# Altium schematic sheet [04] - PWR 2V5, 1V8, 1V35.SchDoc
size A4; DocumentNumber: 4; SheetNumber: 4; SheetTotal: 15
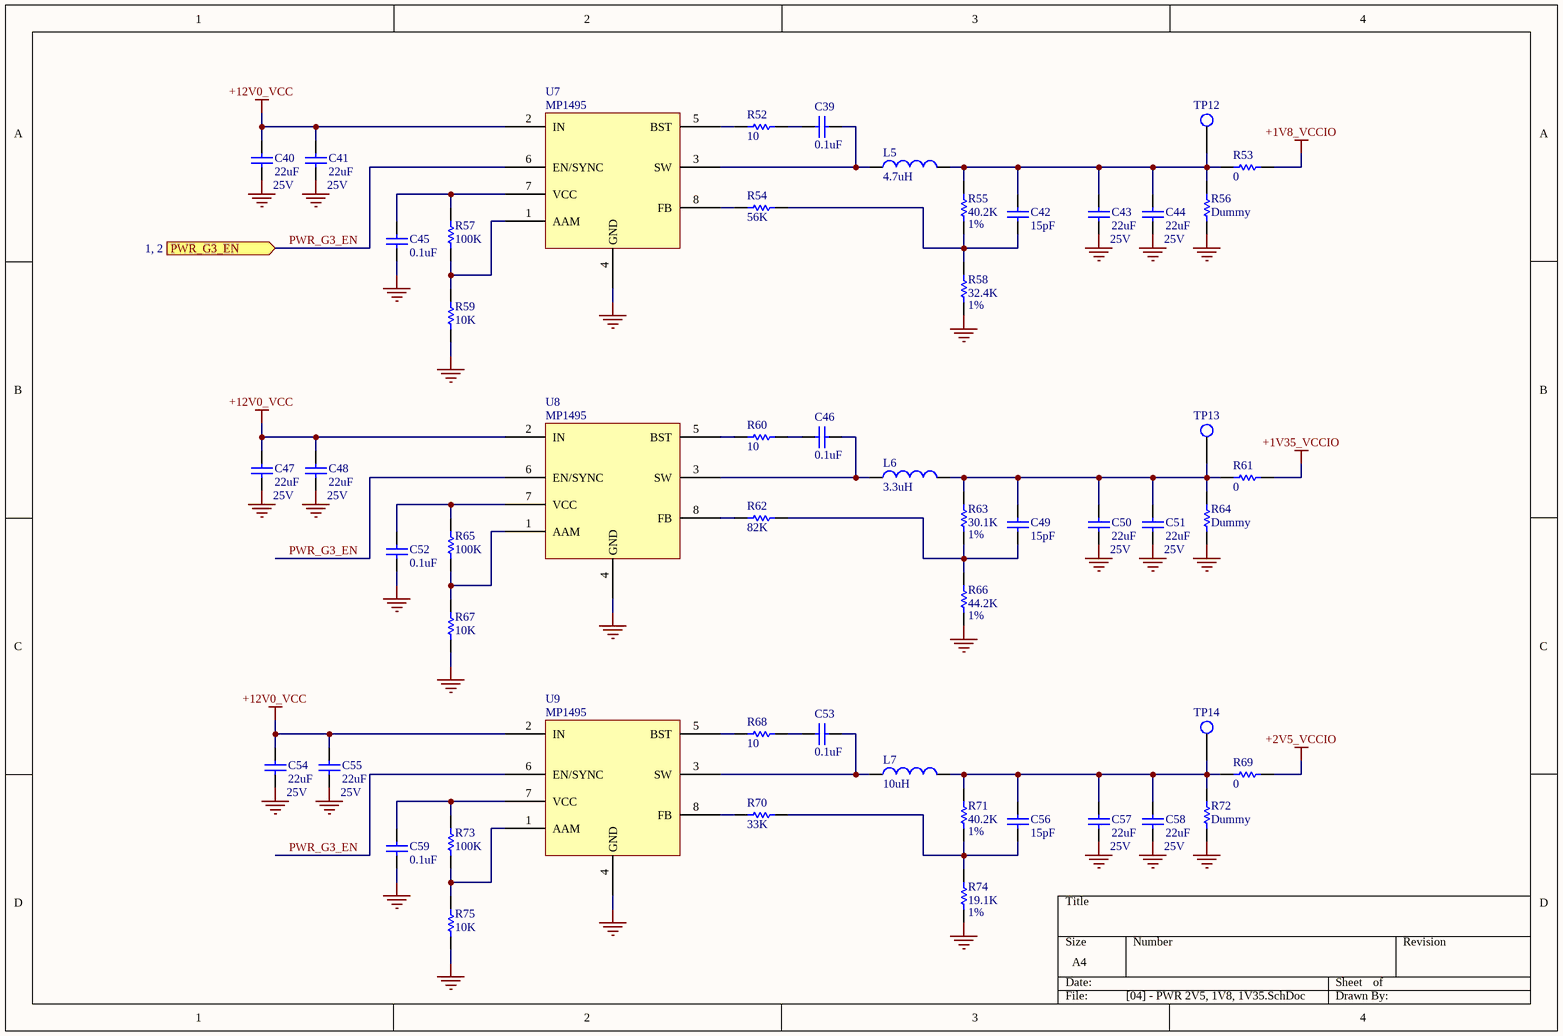
[diagram p0: [04] - PWR 2V5, 1V8, 1V35.SchDoc]

## Parts
C39  0.1uF  [0402_C]
C40  22uF  RATED_VOLTAGE: 25V  [1210_C]
C41  22uF  RATED_VOLTAGE: 25V  [1210_C]
C42  15pF  [0402_C]
C43  22uF  RATED_VOLTAGE: 25V  [1210_C]
C44  22uF  RATED_VOLTAGE: 25V  [1210_C]
C45  0.1uF  [0402_C]
C46  0.1uF  [0402_C]
C47  22uF  RATED_VOLTAGE: 25V  [1210_C]
C48  22uF  RATED_VOLTAGE: 25V  [1210_C]
C49  15pF  [0402_C]
C50  22uF  RATED_VOLTAGE: 25V  [1210_C]
C51  22uF  RATED_VOLTAGE: 25V  [1210_C]
C52  0.1uF  [0402_C]
C53  0.1uF  [0402_C]
C54  22uF  RATED_VOLTAGE: 25V  [1210_C]
C55  22uF  RATED_VOLTAGE: 25V  [1210_C]
C56  15pF  [0402_C]
C57  22uF  RATED_VOLTAGE: 25V  [1210_C]
C58  22uF  RATED_VOLTAGE: 25V  [1210_C]
C59  0.1uF  [0402_C]
L5  4.7uH  [IHLP-2525]
L6  3.3uH  [IHLP-2020]
L7  10uH  [IHLP-2525]
R52  10  [0402_R]
R53  0  [1210_R]
R54  56K  [0402_R]
R55  40.2K  Tolerance: 1%  [0402_R]
R56  Dummy  [1210_R]
R57  100K  [0402_R]
R58  32.4K  Tolerance: 1%  [0402_R]
R59  10K  [0402_R]
R60  10  [0402_R]
R61  0  [1210_R]
R62  82K  [0402_R]
R63  30.1K  Tolerance: 1%  [0402_R]
R64  Dummy  [1210_R]
R65  100K  [0402_R]
R66  44.2K  Tolerance: 1%  [0402_R]
R67  10K  [0402_R]
R68  10  [0402_R]
R69  0  [1210_R]
R70  33K  [0402_R]
R71  40.2K  Tolerance: 1%  [0402_R]
R72  Dummy  [1210_R]
R73  100K  [0402_R]
R74  19.1K  Tolerance: 1%  [0402_R]
R75  10K  [0402_R]
TP12  Test Point  [PIN_1.5mm]  (value not drawn)
TP13  Test Point  [PIN_1.5mm]  (value not drawn)
TP14  Test Point  [PIN_1.5mm]  (value not drawn)
U7  MP1495  [TSOT23-8]
U8  MP1495  [TSOT23-8]
U9  MP1495  [TSOT23-8]

## Ports
PWR_G3_EN (in, see 1, 2)

## Nets
+1V8_VCCIO: R53.2
+1V35_VCCIO: R61.2
+2V5_VCCIO: R69.2
+12V0_VCC: C40.2 C41.2 C47.2 C48.2 C54.2 C55.2 U7.2(IN) U8.2(IN) U9.2(IN)
GND: C40.1 C41.1 C43.1 C44.1 C45.1 C47.1 C48.1 C50.1 C51.1 C52.1 C54.1 C55.1 C57.1 C58.1 C59.1 R56.1 R58.1 R59.1 R64.1 R66.1 R67.1 R72.1 R74.1 R75.1 U7.4(GND) U8.4(GND) U9.4(GND)
PWR_G3_EN: U7.6(EN/SYNC) U8.6(EN/SYNC) U9.6(EN/SYNC) ; port PWR_G3_EN
NetC39_1: C39.1 R52.2
NetC39_2: C39.2 L5.1 U7.3(SW)
NetC42_1: C42.1 R54.2 R55.1 R58.2
NetC42_2: C42.2 C43.2 C44.2 L5.2 R53.1 R55.2 R56.2 TP12.1
NetC45_2: C45.2 R57.2 U7.7(VCC)
NetC46_1: C46.1 R60.2
NetC46_2: C46.2 L6.1 U8.3(SW)
NetC49_1: C49.1 R62.2 R63.1 R66.2
NetC49_2: C49.2 C50.2 C51.2 L6.2 R61.1 R63.2 R64.2 TP13.1
NetC52_2: C52.2 R65.2 U8.7(VCC)
NetC53_1: C53.1 R68.2
NetC53_2: C53.2 L7.1 U9.3(SW)
NetC56_1: C56.1 R70.2 R71.1 R74.2
NetC56_2: C56.2 C57.2 C58.2 L7.2 R69.1 R71.2 R72.2 TP14.1
NetC59_2: C59.2 R73.2 U9.7(VCC)
NetR52_1: R52.1 U7.5(BST)
NetR54_1: R54.1 U7.8(FB)
NetR57_1: R57.1 R59.2 U7.1(AAM)
NetR60_1: R60.1 U8.5(BST)
NetR62_1: R62.1 U8.8(FB)
NetR65_1: R65.1 R67.2 U8.1(AAM)
NetR68_1: R68.1 U9.5(BST)
NetR70_1: R70.1 U9.8(FB)
NetR73_1: R73.1 R75.2 U9.1(AAM)

## Library data of the parts
C39 C45 C46 C52 C53 C59 = Cap SMD: Non-Pol SMD Capacitor; RATED_VOLTAGE: 25V; Value: 0.1uF; Manufacturer Part Num: *; Dielectric: *
C40 C41 C43 C44 C47 C48 C50 C51 C54 C55 C57 C58 = Cap SMD: Non-Pol SMD Capacitor; Manufacturer Part Num: GRM32ER71E226KE15; Dielectric: X7R; Value: 22uF
C42 C49 C56 = Cap SMD: Non-Pol SMD Capacitor; RATED_VOLTAGE: 16V; Value: 15pF; Manufacturer Part Num: *; Dielectric: *
L5 = Inductor: Inductor SMD; Manufacturer Part Num: IHLP2525CZER4R7M01; Value: 4.7uH
L6 = Inductor: Inductor SMD; Manufacturer Part Num: IHLP2020BZER3R3M5A; Value: 3.3uH
L7 = Inductor: Inductor SMD; Manufacturer Part Num: IHLP2525CZER100M01; Value: 10uH
R52-R54 R56 R57 R59-R62 R64 R65 R67-R70 R72 R73 R75 = Res SMD: SMD Resistor; Tolerance: 5%; Manufacturer Part Num: *
  R52 R60 R68: Value: 10
  R53 R61 R69: Value: 0
  R54: Value: 56K
  R56 R64 R72: Value: Dummy
  R57 R65 R73: Value: 100K
  R59 R67 R75: Value: 10K
  R62: Value: 82K
  R70: Value: 33K
R55 R58 R63 R66 R71 R74 = Res SMD: SMD Resistor; Manufacturer Part Num: *
  R55 R71: Value: 40.2K
  R58: Value: 32.4K
  R63: Value: 30.1K
  R66: Value: 44.2K
  R74: Value: 19.1K
TP12-TP14 = Test Point: Test Point Footprint; Value: Test Point
U7-U9 = MP1495: High Efficiency 3A, 16V, 500kHz Synchronous Step Down Converter; Manufacturer Part Num: MP1495SGJ-Z; Value: MP1495